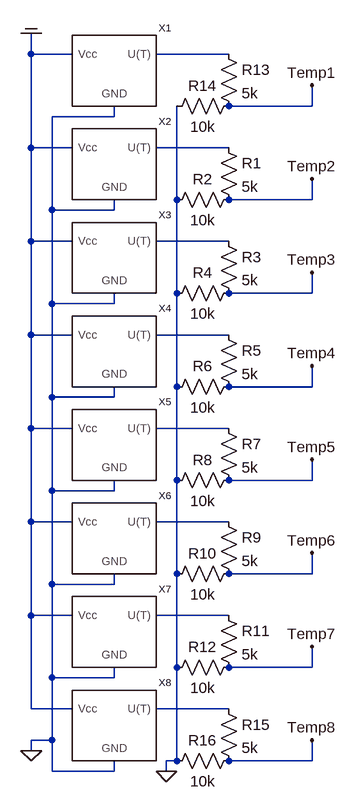
[diagram p0: schematic Termistorji.asc]
Termistorji.asc, the LTspice schematic file:
Version 4
SHEET 1 880 816
WIRE -896 -400 -896 -432
WIRE -832 -400 -896 -400
WIRE -592 -400 -704 -400
WIRE -464 -320 -464 -352
WIRE -464 -320 -592 -320
WIRE -768 -304 -768 -320
WIRE -768 -304 -864 -304
WIRE -896 -256 -896 -400
WIRE -832 -256 -896 -256
WIRE -592 -256 -704 -256
WIRE -672 -176 -672 -320
WIRE -464 -176 -464 -208
WIRE -464 -176 -592 -176
WIRE -864 -160 -864 -304
WIRE -768 -160 -768 -176
WIRE -768 -160 -864 -160
WIRE -896 -112 -896 -256
WIRE -832 -112 -896 -112
WIRE -592 -112 -704 -112
WIRE -672 -32 -672 -176
WIRE -464 -32 -464 -64
WIRE -464 -32 -592 -32
WIRE -864 -16 -864 -160
WIRE -768 -16 -768 -32
WIRE -768 -16 -864 -16
WIRE -896 32 -896 -112
WIRE -832 32 -896 32
WIRE -592 32 -704 32
WIRE -672 112 -672 -32
WIRE -464 112 -464 80
WIRE -464 112 -592 112
WIRE -864 128 -864 -16
WIRE -768 128 -768 112
WIRE -768 128 -864 128
WIRE -896 176 -896 32
WIRE -832 176 -896 176
WIRE -592 176 -704 176
WIRE -672 256 -672 112
WIRE -464 256 -464 224
WIRE -464 256 -592 256
WIRE -864 272 -864 128
WIRE -768 272 -768 256
WIRE -768 272 -864 272
WIRE -896 320 -896 176
WIRE -832 320 -896 320
WIRE -592 320 -704 320
WIRE -672 400 -672 256
WIRE -464 400 -464 368
WIRE -464 400 -592 400
WIRE -864 416 -864 272
WIRE -768 416 -768 400
WIRE -768 416 -864 416
WIRE -896 464 -896 320
WIRE -832 464 -896 464
WIRE -592 464 -704 464
WIRE -672 544 -672 400
WIRE -464 544 -464 512
WIRE -464 544 -592 544
WIRE -864 560 -864 416
WIRE -768 560 -768 544
WIRE -768 560 -864 560
WIRE -896 608 -896 464
WIRE -832 608 -896 608
WIRE -592 608 -704 608
WIRE -864 656 -864 560
WIRE -864 656 -896 656
WIRE -896 672 -896 656
WIRE -672 688 -672 544
WIRE -672 688 -688 688
WIRE -464 688 -464 656
WIRE -464 688 -592 688
WIRE -864 704 -864 656
WIRE -768 704 -768 688
WIRE -768 704 -864 704
WIRE -688 704 -688 688
FLAG -896 672 0
FLAG -896 -432 COM
FLAG -688 704 0
FLAG -464 -352 Temp1
FLAG -464 -208 Temp2
FLAG -464 -64 Temp3
FLAG -464 80 Temp4
FLAG -464 224 Temp5
FLAG -464 368 Temp6
FLAG -464 512 Temp7
FLAG -464 656 Temp8
SYMBOL ozbolt\\Termistor -768 -368 R0
SYMATTR InstName X1
SYMBOL ozbolt\\Termistor -768 -224 R0
SYMATTR InstName X2
SYMBOL ozbolt\\Termistor -768 -80 R0
SYMATTR InstName X3
SYMBOL ozbolt\\Termistor -768 64 R0
SYMATTR InstName X4
SYMBOL ozbolt\\Termistor -768 208 R0
SYMATTR InstName X5
SYMBOL ozbolt\\Termistor -768 352 R0
SYMATTR InstName X6
SYMBOL ozbolt\\Termistor -768 496 R0
SYMATTR InstName X7
SYMBOL ozbolt\\Termistor -768 640 R0
SYMATTR InstName X8
SYMBOL res -608 -272 R0
SYMATTR InstName R1
SYMATTR Value 5k
SYMBOL res -576 -192 R90
WINDOW 0 0 56 VBottom 2
WINDOW 3 32 56 VTop 2
SYMATTR InstName R2
SYMATTR Value 10k
SYMBOL res -608 -128 R0
SYMATTR InstName R3
SYMATTR Value 5k
SYMBOL res -576 -48 R90
WINDOW 0 0 56 VBottom 2
WINDOW 3 32 56 VTop 2
SYMATTR InstName R4
SYMATTR Value 10k
SYMBOL res -608 16 R0
SYMATTR InstName R5
SYMATTR Value 5k
SYMBOL res -576 96 R90
WINDOW 0 0 56 VBottom 2
WINDOW 3 32 56 VTop 2
SYMATTR InstName R6
SYMATTR Value 10k
SYMBOL res -608 160 R0
SYMATTR InstName R7
SYMATTR Value 5k
SYMBOL res -576 240 R90
WINDOW 0 0 56 VBottom 2
WINDOW 3 32 56 VTop 2
SYMATTR InstName R8
SYMATTR Value 10k
SYMBOL res -608 304 R0
SYMATTR InstName R9
SYMATTR Value 5k
SYMBOL res -576 384 R90
WINDOW 0 0 56 VBottom 2
WINDOW 3 32 56 VTop 2
SYMATTR InstName R10
SYMATTR Value 10k
SYMBOL res -608 448 R0
SYMATTR InstName R11
SYMATTR Value 5k
SYMBOL res -576 528 R90
WINDOW 0 0 56 VBottom 2
WINDOW 3 32 56 VTop 2
SYMATTR InstName R12
SYMATTR Value 10k
SYMBOL res -608 -416 R0
SYMATTR InstName R13
SYMATTR Value 5k
SYMBOL res -576 -336 R90
WINDOW 0 0 56 VBottom 2
WINDOW 3 32 56 VTop 2
SYMATTR InstName R14
SYMATTR Value 10k
SYMBOL res -608 592 R0
SYMATTR InstName R15
SYMATTR Value 5k
SYMBOL res -576 672 R90
WINDOW 0 0 56 VBottom 2
WINDOW 3 32 56 VTop 2
SYMATTR InstName R16
SYMATTR Value 10k

The netlist it stands for:
* Termistorji.asc
XX1 COM N001 0 Termistor  ; pins Vcc U(T) GND
XX2 COM N002 0 Termistor  ; pins Vcc U(T) GND
XX3 COM N003 0 Termistor  ; pins Vcc U(T) GND
XX4 COM N004 0 Termistor  ; pins Vcc U(T) GND
XX5 COM N005 0 Termistor  ; pins Vcc U(T) GND
XX6 COM N006 0 Termistor  ; pins Vcc U(T) GND
XX7 COM N007 0 Termistor  ; pins Vcc U(T) GND
XX8 COM N008 0 Termistor  ; pins Vcc U(T) GND
R1 N002 Temp2 5k
R2 Temp2 0 10k
R3 N003 Temp3 5k
R4 Temp3 0 10k
R5 N004 Temp4 5k
R6 Temp4 0 10k
R7 N005 Temp5 5k
R8 Temp5 0 10k
R9 N006 Temp6 5k
R10 Temp6 0 10k
R11 N007 Temp7 5k
R12 Temp7 0 10k
R13 N001 Temp1 5k
R14 Temp1 0 10k
R15 N008 Temp8 5k
R16 Temp8 0 10k
.backanno
.end